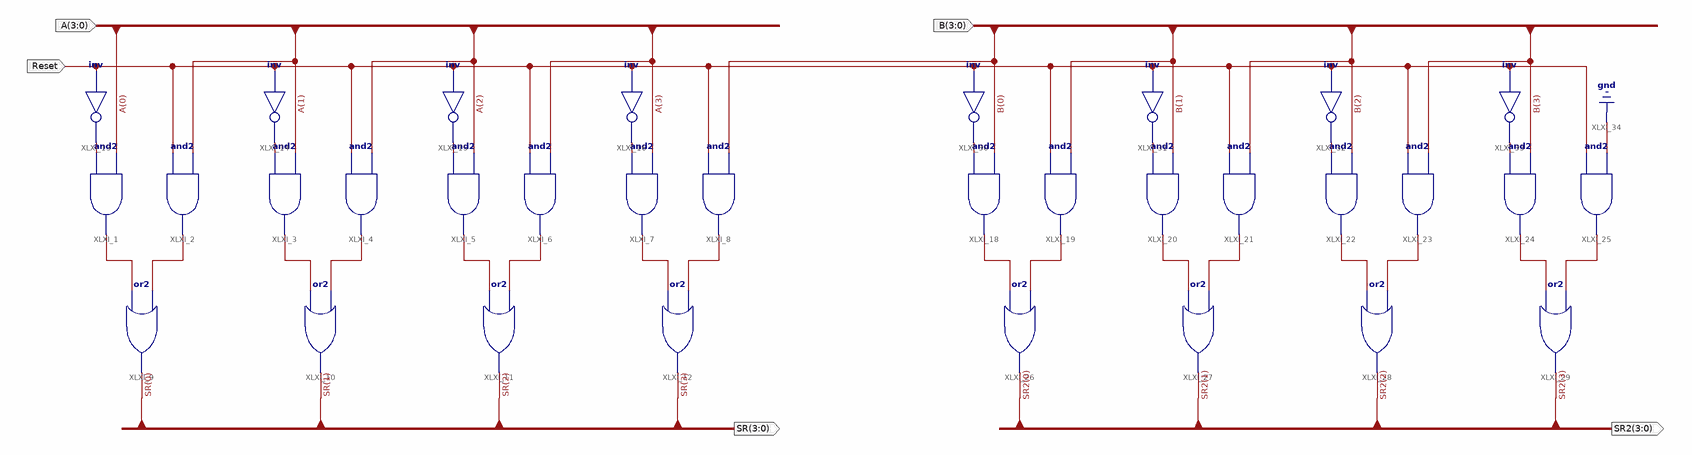
[diagram p0: schematic sheet 1]
// Xilinx ISE schematic RightShift8Bit.sch (artix7) as structural Verilog: 32 symbols, 5 ports
module RightShift8Bit (
  input  [3:0] A,
  input  Reset,
  input  [3:0] B,
  output [3:0] SR,
  output [3:0] SR2
);

  wire XLXN_2, XLXN_3, XLXN_4, XLXN_5, XLXN_6, XLXN_7, XLXN_8, XLXN_9, XLXN_10, XLXN_11, XLXN_12, XLXN_13,
       XLXN_31, XLXN_32, XLXN_33, XLXN_34, XLXN_35, XLXN_36, XLXN_37, XLXN_38, XLXN_39, XLXN_40, XLXN_41,
       XLXN_42;

  and XLXI_1 (XLXN_6, XLXN_2, A[0]);
  and XLXI_2 (XLXN_7, Reset, A[1]);
  and XLXI_3 (XLXN_8, XLXN_3, A[1]);
  and XLXI_4 (XLXN_9, Reset, A[2]);
  and XLXI_5 (XLXN_10, XLXN_4, A[2]);
  and XLXI_6 (XLXN_11, Reset, A[3]);
  and XLXI_7 (XLXN_12, XLXN_5, A[3]);
  and XLXI_8 (XLXN_13, Reset, B[0]);
  or XLXI_9 (SR[0], XLXN_6, XLXN_7);
  or XLXI_10 (SR[1], XLXN_8, XLXN_9);
  or XLXI_11 (SR[2], XLXN_10, XLXN_11);
  or XLXI_12 (SR[3], XLXN_12, XLXN_13);
  not XLXI_13 (XLXN_2, Reset);
  not XLXI_14 (XLXN_3, Reset);
  not XLXI_15 (XLXN_4, Reset);
  not XLXI_16 (XLXN_5, Reset);
  and XLXI_18 (XLXN_35, XLXN_31, B[0]);
  and XLXI_19 (XLXN_36, Reset, B[1]);
  and XLXI_20 (XLXN_37, XLXN_32, B[1]);
  and XLXI_21 (XLXN_38, Reset, B[2]);
  and XLXI_22 (XLXN_39, XLXN_33, B[2]);
  and XLXI_23 (XLXN_40, Reset, B[3]);
  and XLXI_24 (XLXN_41, XLXN_34, B[3]);
  and XLXI_25 (XLXN_42, Reset, 1'b0);
  or XLXI_26 (SR2[0], XLXN_35, XLXN_36);
  or XLXI_27 (SR2[1], XLXN_37, XLXN_38);
  or XLXI_28 (SR2[2], XLXN_39, XLXN_40);
  or XLXI_29 (SR2[3], XLXN_41, XLXN_42);
  not XLXI_30 (XLXN_31, Reset);
  not XLXI_31 (XLXN_32, Reset);
  not XLXI_32 (XLXN_33, Reset);
  not XLXI_33 (XLXN_34, Reset);
endmodule
